# EAGLE design arduinoXbeere (EAGLE 4.16)
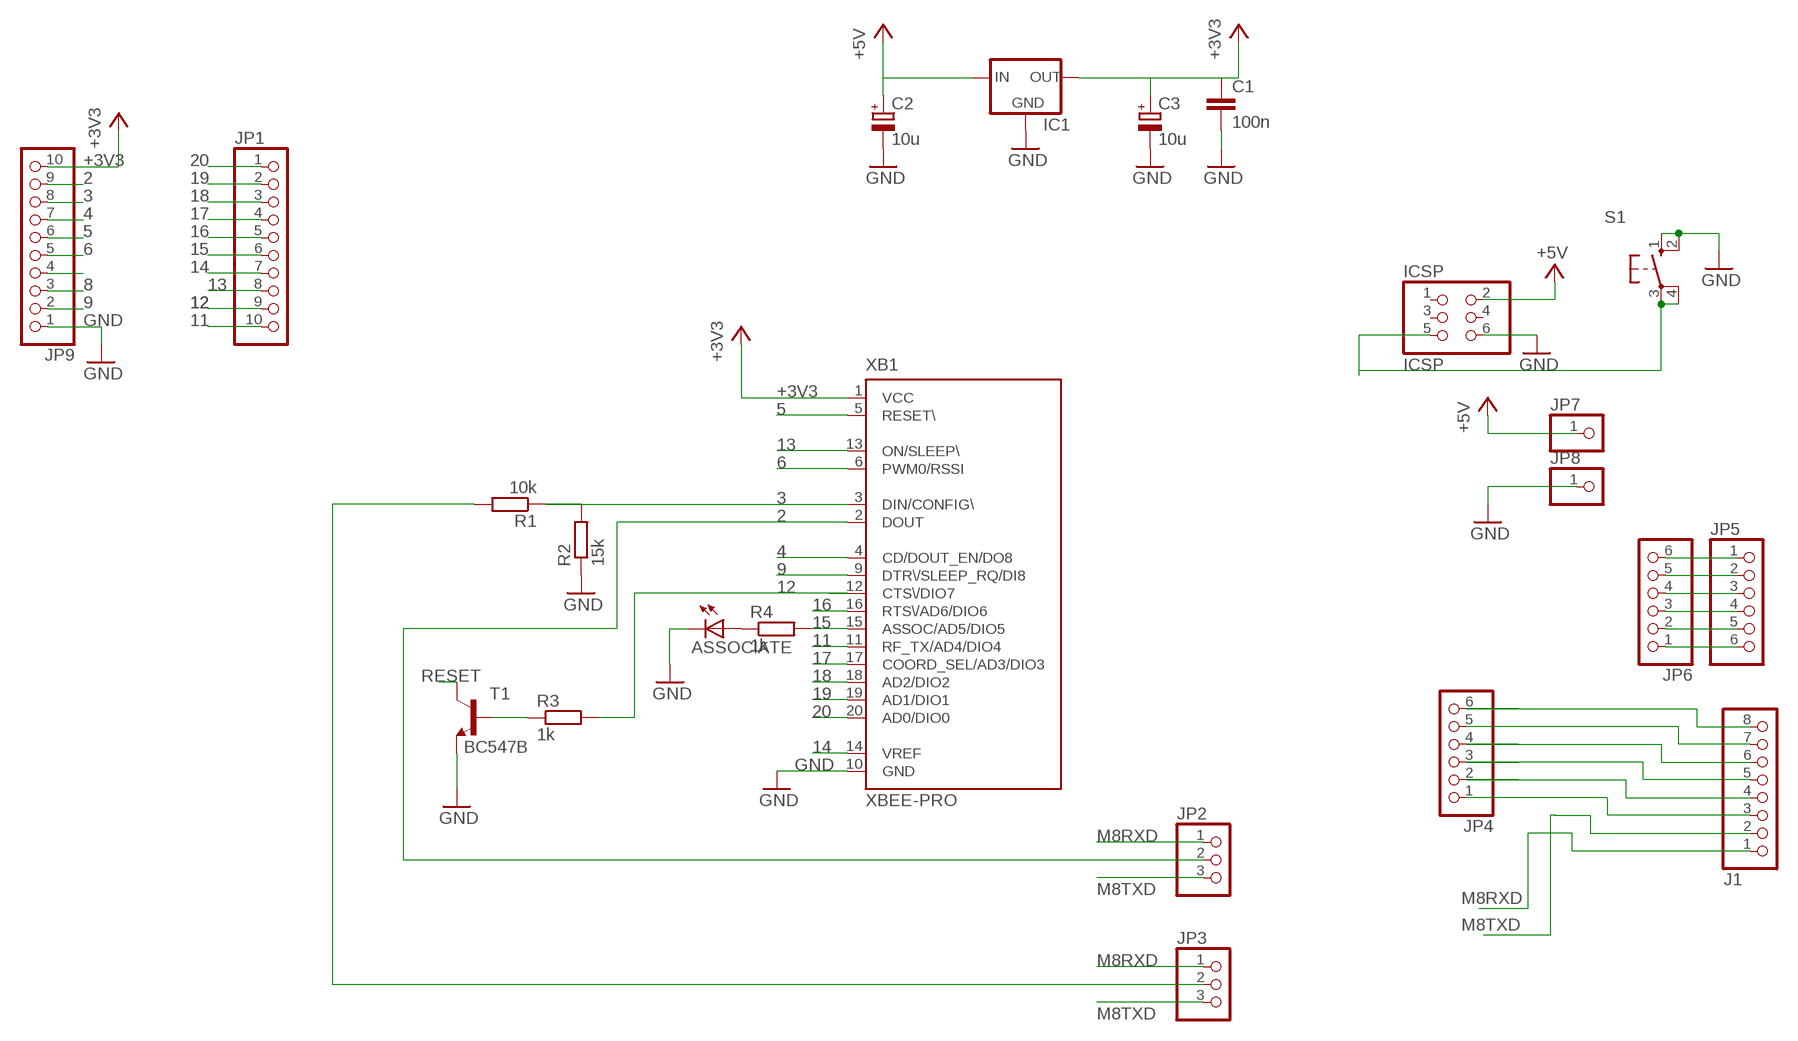
[diagram p0: schematic, sheet 1]

## Parts
ASSOCIATE  LED3MM  [LED3MM]
C1  100n  C-EU025-025X050  [C025-025X050]
C2  10u  CPOL-EUE2.5-7  [E2,5-7]
C3  10u  CPOL-EUE2.5-7  [E2,5-7]
IC1  78XXL  [78XXL]
ICSP  ICSP  PINHD-2X3  [2X03]
J1  PINHD-1X8  [1X08]
JP1  PINHD-1X10  [1X10]
JP2  PINHD-1X3  [1X03]
JP3  PINHD-1X3  [1X03]
JP4  PINHD-1X6  [1X06]
JP5  PINHD-1X6  [1X06]
JP6  PINHD-1X6  [1X06]
JP7  PINHD-1X1  [1X01]
JP8  PINHD-1X1  [1X01]
JP9  PINHD-1X10  [1X10]
R1  10k  R-EU_0207/10  [0207/10]
R2  15k  R-EU_0207/10  [0207/10]
R3  1k  R-EU_0207/10  [0207/10]
R4  1k  R-EU_0207/10  [0207/10]
S1  10-XX  [B3F-10XX]
T1  BC547B  [TO92]
XB1  XBEE-PRO  [XBEE-PRO]

## Nets
2: JP2.2 JP9.9 XB1.2(DOUT)
3: JP9.8 R1.1 R2.2 XB1.3(DIN/CONFIG\)
4: JP9.7 XB1.4(CD/DOUT_EN/DO8)
5: JP9.6 XB1.5(RESET\)
6: JP9.5 XB1.6(PWM0/RSSI)
8: JP9.3
9: JP9.2 XB1.9(DTR\/SLEEP_RQ/DI8)
11: JP1.10 XB1.11(RF_TX/AD4/DIO4)
12: JP1.9 R3.2 XB1.12(CTS\/DIO7)
13: JP1.8 XB1.13(ON/SLEEP\)
14: JP1.7 XB1.14(VREF)
15: JP1.6 R4.2 XB1.15(ASSOC/AD5/DIO5)
16: JP1.5 XB1.16(RTS\/AD6/DIO6)
17: JP1.4 XB1.17(COORD_SEL/AD3/DIO3)
18: JP1.3 XB1.18(AD2/DIO2)
19: JP1.2 XB1.19(AD1/DIO1)
20: JP1.1 XB1.20(AD0/DIO0)
+3V3: C1.1 C3.+ IC1.OUT JP9.10 XB1.1(VCC)
+5V [power]: C2.+ IC1.IN ICSP.2 JP7.1
GND [power]: ASSOCIATE.K(C) C1.2 C2.- C3.- IC1.GND ICSP.6 JP8.1 JP9.1 R2.1 S1.1(S) S1.2(S1) T1.1(E) XB1.10(GND)
M8RXD: J1.1 JP2.1 JP3.1
M8TXD: J1.2 JP2.3 JP3.3
N$1: ASSOCIATE.A R4.1
N$2: JP5.6 JP6.1
N$3: JP5.5 JP6.2
N$4: JP5.4 JP6.3
N$5: JP3.2 R1.2
N$6: R3.1 T1.2(B)
N$8: JP5.3 JP6.4
N$9: JP5.2 JP6.5
N$10: J1.3 JP4.1
N$11: J1.4 JP4.2
N$12: J1.5 JP4.3
N$13: J1.6 JP4.4
N$14: J1.7 JP4.5
N$15: J1.8 JP4.6
N$16: JP5.1 JP6.6
N$19: JP9.4
RESET: ICSP.5 S1.3(P) S1.4(P1) T1.3(C)
Unconnected: ICSP.1 ICSP.3 ICSP.4

## Library data of the parts
ASSOCIATE = led:LED: LED OSRAM: - CHIPLED LG R971, LG N971, LY N971, LG Q971, LY Q971, LO R971, LY R971 LH N974, LH R974 LS Q976, LO Q976, LY Q976 LO Q996 - Hyper CHIPLED LW Q18S LB Q993, LB Q99A, LB R99A - SideLED LS A670, LO A670, LY A670, LG A670, LP A670 LB A673, LV A673, LT A673, LW A673 LH A674 LY A675 LS A676, LA A676, LO A676, LY A676, LW A676 LS A679, LY A679, LG A679 - Hyper Micro SIDELED® LS Y876, LA Y876, LO Y876, LY Y876 LT Y87S - SmartLED LW L88C, LW L88S LB L89C, LB L89S, LG L890 LS L89K, LO L89K, LY L89K LS L896, LA L896, LO L896, LY L896 - TOPLED LS T670, LO T670, LY T670, LG T670, LP T670 LSG T670, LSP T670, LSY T670, LOP T670, LYG T670 LG T671, LOG T671, LSG T671 LB T673, LV T673, LT T673, LW T673 LH T674 LS T676, LA T676, LO T676, LY T676, LB T676, LH T676, LSB T676, LW T676 LB T67C, LV T67C, LT T67C, LS T67K, LO T67K, LY T67K, LW E67C LS E67B, LA E67B, LO E67B, LY E67B, LB E67C, LV E67C, LT E67C LW T67C LS T679, LY T679, LG T679 LS T770, LO T770, LY T770, LG T770, LP T770 LB T773, LV T773, LT T773, LW T773 LH T774 LS E675, LA E675, LY E675, LS T675 LS T776, LA T776, LO T776, LY T776, LB T776 LHGB T686 LT T68C, LB T68C - Hyper Mini TOPLED® LB M676 - Mini TOPLED Santana® LG M470 LS M47K, LO M47K, LY M47K Source: http://www.osram.convergy.de/
C1 = rcl:C-EU: CAPACITOR, European symbol
C2 C3 = rcl:CPOL-EU: POLARIZED CAPACITOR, European symbol
IC1 = v-reg:78XXL: VOLTAGE REGULATOR
ICSP = pinhead:PINHD-2X3: PIN HEADER
J1 = pinhead:PINHD-1X8: PIN HEADER
JP1 JP9 = pinhead:PINHD-1X10: PIN HEADER
JP2 JP3 = pinhead:PINHD-1X3: PIN HEADER
JP4-JP6 = pinhead:PINHD-1X6: PIN HEADER
JP7 JP8 = pinhead:PINHD-1X1: PIN HEADER
R1-R4 = rcl:R-EU_: RESISTOR, European symbol
S1 = switch-omron:10-XX: OMRON SWITCH
T1 = transistor-npn:BC547*: NPN Transistor
XB1 = maxstream:XBEE: XBee (TM) /XBee-PRO(TM) OEM RF Modules Source: MaxStream, Inc. xbee_productmanual.pdf

## Net classes
1 power: width 0.61 mm

## Board
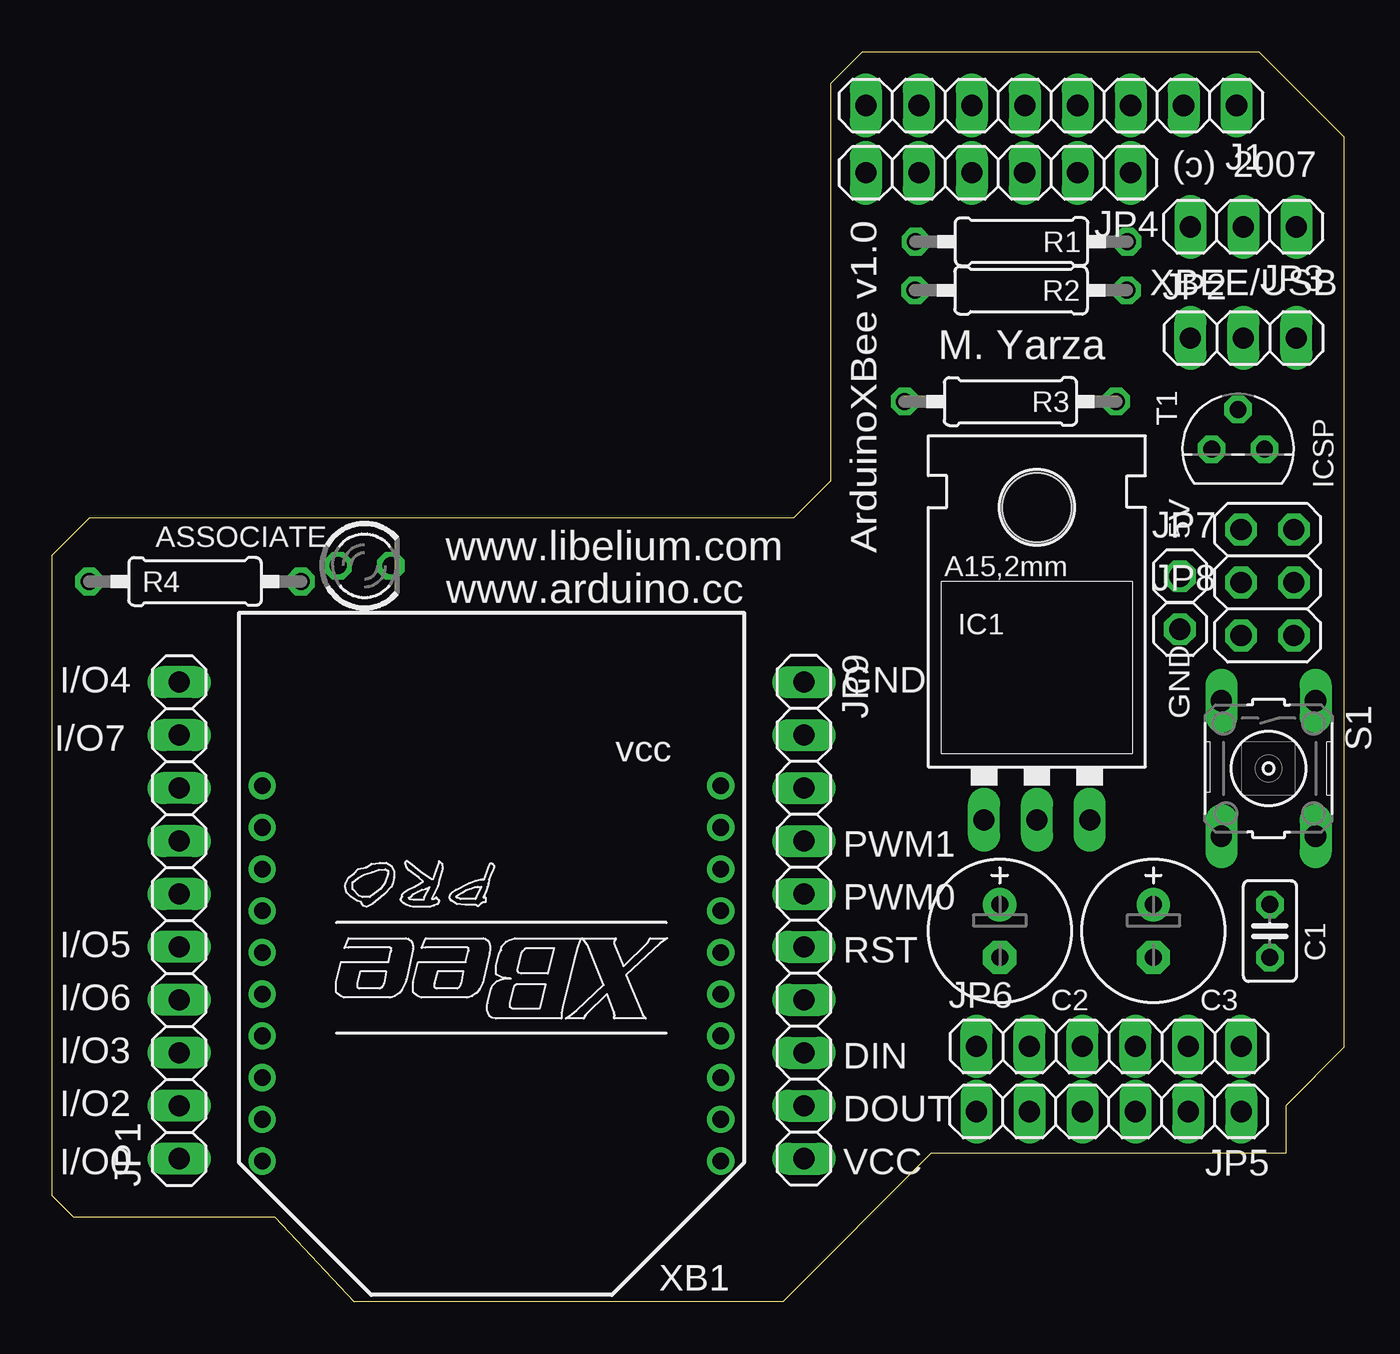
[diagram p1: board, top side]
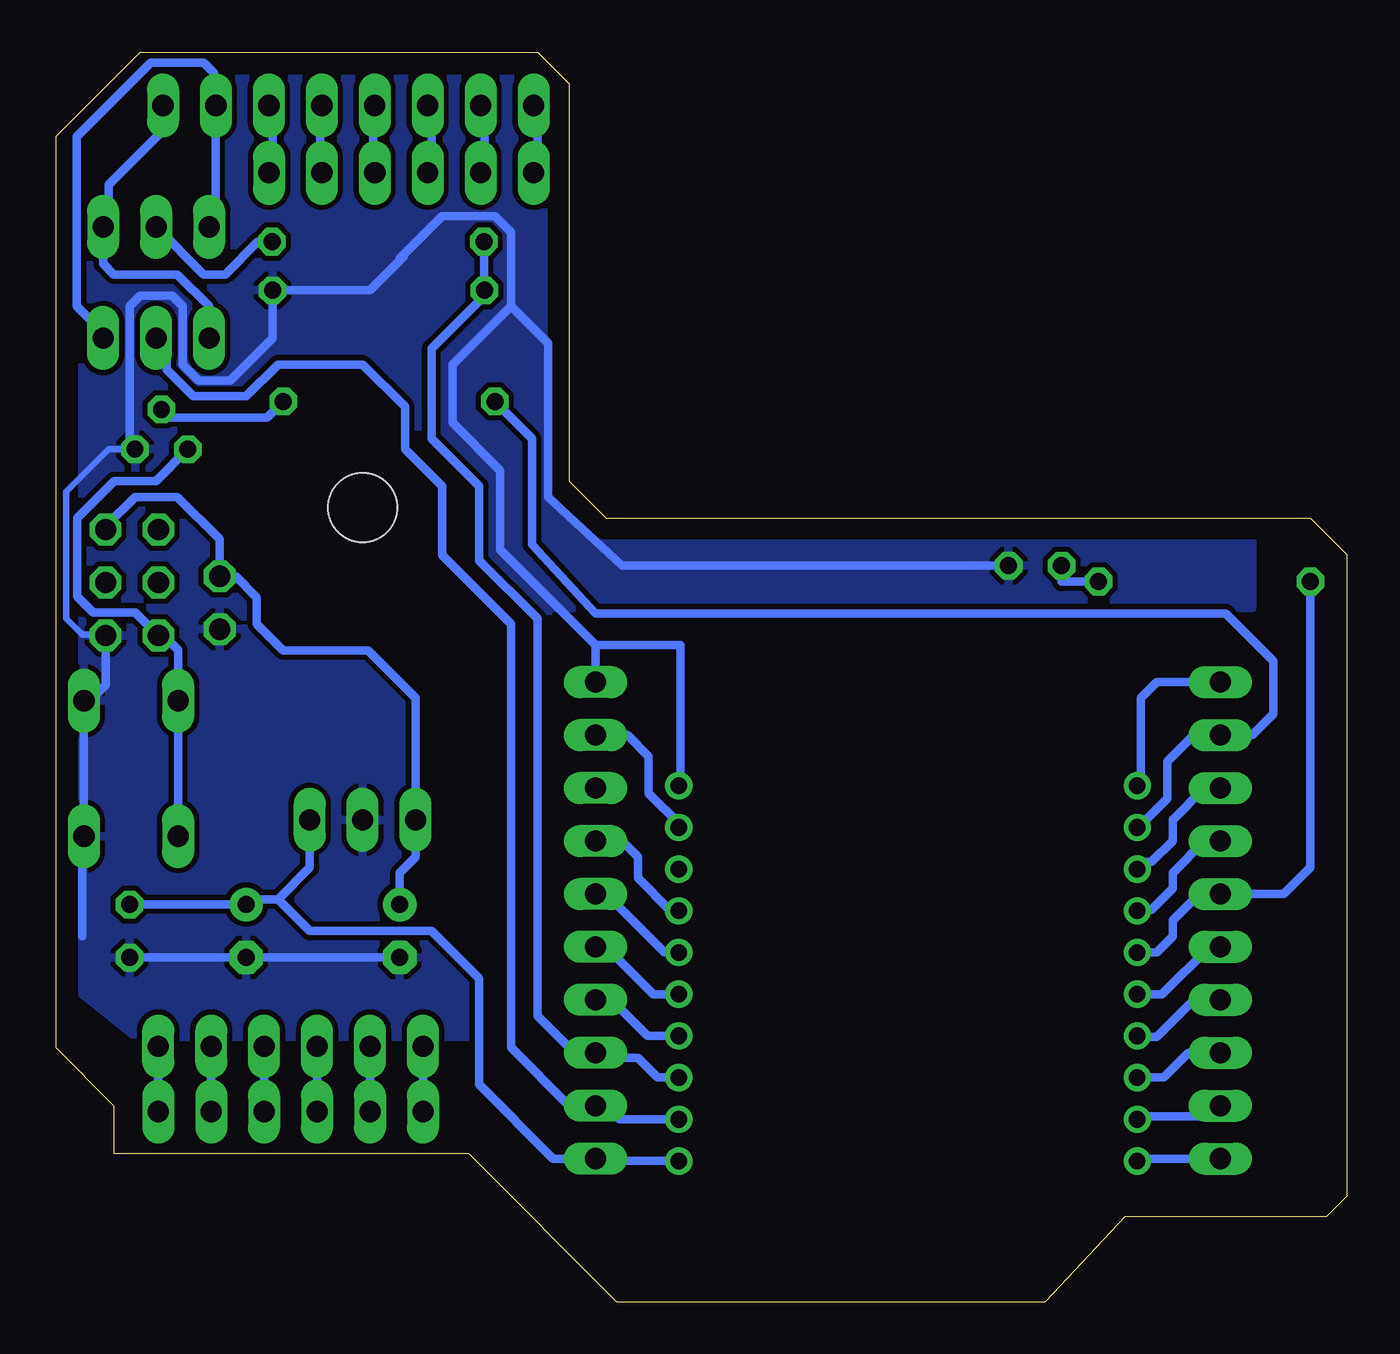
[diagram p2: board, bottom side, seen from below]

Size 61.98 x 59.94 mm. Coordinates in mm from the lower left corner, seen from the top.
Outline: 61.98,44.7 61.98,44.45
Outline: 61.98,44.45 61.98,55.88 57.91,59.94 38.86,59.94 37.34,58.42 37.34,39.37
Outline: 61.98,44.45 61.98,12.19 59.18,9.4 59.18,7.11 42.16,7.11 35.05,0 14.48,0 10.67,4.06 1.02,4.06 0,5.08 0,35.81 1.78,37.59 35.56,37.59 37.34,39.37
Outline: 37.34,39.37 37.34,39.34
Copper layers (1*16): Top 0.035mm / dielectric 1.5mm / Bottom 0.035mm
Design rules "default": minimum track width 10mil, minimum drill 24mil, track to track 8mil, track to pad 8mil, pad to pad 8mil, via to via 8mil, smd to smd 8mil, copper to edge 40mil, drill to drill 8mil, minimum pad ring 10mil, minimum via ring 8mil, stop-mask expansion 4mil, vias tented up to drill 0mil, thermal gap 10mil

### Footprints (pad centres in the part's own frame; a part is rotated, then mirrored left to right if it is on the bottom)
LED3MM = drill 0.813 octagon: A -1.27,0; K 1.27,0
C025-025X050 = drill 0.813 octagon: 1 -1.27,0; 2 1.27,0
E2,5-7 = drill 0.813 pad 1.6 round: + -1.27,0 | drill 0.813 pad 1.6 octagon: - 1.27,0
78XXL = drill 1.016 long: GND 0,-3.81; IN -2.54,-3.81; OUT 2.54,-3.81 | hole 3.302: 0,11.176
2X03 = drill 1.016 octagon: 1 -2.54,-1.27; 2 -2.54,1.27; 3 0,-1.27; 4 0,1.27; 5 2.54,-1.27; 6 2.54,1.27
1X08 = drill 1.016 long: 1 -8.89,0; 2 -6.35,0; 3 -3.81,0; 4 -1.27,0; 5 1.27,0; 6 3.81,0; 7 6.35,0; 8 8.89,0
1X10 = drill 1.016 long: 1 -11.43,0; 2 -8.89,0; 3 -6.35,0; 4 -3.81,0; 5 -1.27,0; 6 1.27,0; 7 3.81,0; 8 6.35,0; 9 8.89,0; 10 11.43,0
1X03 = drill 1.016 long: 1 -2.54,0; 2 0,0; 3 2.54,0
1X06 = drill 1.016 long: 1 -6.35,0; 2 -3.81,0; 3 -1.27,0; 4 1.27,0; 5 3.81,0; 6 6.35,0
1X01 = drill 1.016 octagon: 1 0,0
0207/10 = drill 0.813 octagon: 1 -5.08,0; 2 5.08,0
B3F-10XX = drill 1.016 long: 1 -3.251,2.261; 2 3.251,2.261; 3 -3.251,-2.261; 4 3.251,-2.261
TO92 = drill 0.813 octagon: 1 1.27,0; 2 0,1.905; 3 -1.27,0
XBEE-PRO = drill 0.8 pad 1.27 round: 1 -11,9; 2 -11,7; 3 -11,5; 4 -11,3; 5 -11,1; 6 -11,-1; 7 -11,-3; 8 -11,-5; 9 -11,-7; 10 -11,-9; 11 11,-9; 12 11,-7; 13 11,-5; 14 11,-3; 15 11,-1; 16 11,1; 17 11,3; 18 11,5; 19 11,7; 20 11,9

### Placement (x,y rotation side)
ASSOCIATE  14.99,35.31 0 top
C1  58.42,17.78 270 top
C2  45.47,17.78 270 top
C3  52.83,17.78 270 top
IC1  47.24,26.92 0 top
ICSP  58.31,34.49 270 top
J1  47.93,57.38 180 top
JP1  6.1,18.29 90 top
JP2  57.15,46.23 0 top
JP3  57.15,51.56 180 top
JP4  45.39,54.15 180 top
JP5  50.7,9.12 180 top
JP6  50.7,12.24 0 top
JP7  54.1,34.8 0 top
JP8  54.1,32.26 0 top
JP9  36.07,18.29 270 top
R1  46.51,50.85 0 top
R2  46.48,48.51 180 top
R3  45.97,43.18 180 top
R4  6.86,34.54 180 top
S1  58.36,25.58 270 top
T1  56.9,40.89 0 top
XB1  21.08,15.75 180 top

### Tracks (layer width: path | path; a pad name or v marks a point on that pad's centre or on a via)
2
  Bottom 0.406: 57.15,46.48 JP2.2 56.64,45.72 56.64,44.7 55.37,43.43 52.83,43.43 51.31,44.96 47.24,44.96 45.21,42.93 45.21,40.89 43.43,39.12 43.43,35.81 40.13,32.51 40.13,12.19 37.34,9.4 JP9.9 35.56,9.4 34.91,8.75 XB1.2
3
  Bottom 0.406: R1.1 41.43,48.54 R2.2 41.4,48.26 43.94,45.72 43.94,41.4 41.66,39.12 41.66,35.56 38.86,32.77 38.86,13.72 37.08,11.94 JP9.8 | XB1.3 33.1,10.75 34.04,11.68 35.81,11.68 JP9.8 | JP9.8 35.81,11.94
4
  Bottom 0.406: XB1.4 33.58,12.75 35.05,14.22 36.07,14.22 36.32,14.48 JP9.7
5
  Bottom 0.406: XB1.5 33.29,14.75 35.56,17.02 JP9.6
6
  Bottom 0.406: XB1.6 32.75,16.75 35.56,19.56 JP9.5
9
  Bottom 0.406: JP9.2 34.54,27.18 33.53,26.16 33.53,24.38 32,22.86 32.08,22.78 XB1.9
11
  Bottom 0.406: JP1.10 9.14,29.72 9.91,28.96 9.91,24.89 10.08,24.72 | 10.08,24.72 10.16,24.64 | XB1.11 10.08,24.72
12
  Bottom 0.406: XB1.12 10.02,22.75 8.64,24.13 8.64,25.91 7.37,27.18 JP1.9 4.57,27.18 3.56,28.19 3.56,30.73 5.84,33.02 36.07,33.02 39.12,36.32 39.12,41.4 R3.2
13
  Bottom 0.406: JP1.8 6.86,24.64 8.38,23.11 8.38,22.1 9.4,21.08 9.65,21.08 10.08,20.65 | 10.08,20.65 10.16,20.57 | XB1.13 10.08,20.65
14
  Bottom 0.406: JP1.7 6.86,22.1 8.38,20.57 8.38,19.81 9.4,18.8 10.16,18.8 10.11,18.75 XB1.14
15
  Bottom 0.406: XB1.15 9.92,16.75 9.91,16.76 9.14,16.76 8.38,17.53 8.38,18.29 7.11,19.56 JP1.6 3.05,19.56 1.78,20.83 R4.2
16
  Bottom 0.406: JP1.5 6.6,17.02 8.89,14.73 9.91,14.73 9.92,14.75 XB1.16
17
  Bottom 0.406: JP1.4 7.37,14.48 9.14,12.7 9.91,12.7 9.95,12.75 XB1.17
18
  Bottom 0.406: XB1.18 8.81,10.75 7.62,11.94 JP1.3
19
  Bottom 0.406: JP1.2 6.6,8.89 10.16,8.89 10.08,8.81 XB1.19
20
  Bottom 0.406: XB1.20 10.02,6.75 9.91,6.86 JP1.1
+3V3
  Bottom 0.406: IC1.OUT 49.78,20.83 51.31,19.3 | 53.09,19.05 C3.+ | 51.31,19.3 52.83,19.3 53.09,19.05 | 36.32,6.86 JP9.10 | XB1.1 36.21,6.75 36.32,6.86 | 58.17,19.05 C1.1 | 53.09,19.05 58.17,19.05 | 58.17,19.05 58.17,19.3 | 36.32,6.86 38.1,6.86 41.66,10.41 41.66,15.49 43.94,17.78 49.78,17.78 51.31,19.3
+5V
  Bottom 0.406: ICSP.2 59.58,37.2 58.17,38.61 56.13,38.61 54.1,36.58 JP7.1 53.34,34.8 52.32,33.78 52.32,32.51 51.05,31.24 46.99,31.24 44.7,28.96 IC1.IN 44.7,21.34 45.47,20.57 C2.+
GND
  Bottom 0.305: R2.1 49.53,48.51 | 58.42,40.89 59.44,40.89 61.47,38.86 61.47,32.77 60.71,32 59.69,32 59.64,31.95
  Bottom 0.406: 60.71,22.35 60.62,22.44 S1.1 60.58,28.83 60.45,28.7 59.58,29.58 59.58,31.89 59.64,31.95 ICSP.6 | 60.71,22.35 60.68,22.33 S1.2 60.62,22.19 60.71,22.1 | 60.71,22.1 60.71,21.59 | 60.71,22.35 60.71,22.1 | 60.71,22.1 60.71,17.53 | T1.1 58.42,40.89 58.42,47.75 57.91,48.26 56.39,48.26 55.88,47.75 55.88,44.96 55.12,44.2 53.59,44.2 51.56,46.23 R2.1 46.89,48.51 45.41,49.99 | 45.41,49.99 45.29,50.11 | 40.13,47.75 42.93,44.96 42.93,42.16 40.64,39.88 40.64,36.07 36.07,31.5 | 40.13,47.75 40.13,51.31 40.89,52.07 43.43,52.07 45.47,50.04 45.41,49.99 | 36.07,31.5 32,31.5 32,24.67 | 32,24.67 32,24.64 | 32,24.67 XB1.10 | 36.07,31.5 JP9.1 | C2.- C3.- 58.17,16.51 58.42,16.76 C1.2 | ASSOCIATE.K 34.8,35.31 38.35,38.61 38.35,45.97 40.13,47.75
  pour Bottom (isolate 0.254): 4.57,33.27 4.57,36.83 35.81,36.83 38.1,39.12 38.1,58.67 58.67,58.67 60.71,56.39 60.71,14.73 58.17,12.7 38.1,12.7 38.35,13.72 38.35,33.27
M8RXD
  Bottom 0.406: J1.1 56.82,56.21 59.44,53.59 59.44,52.07 59.69,51.82 JP3.1 59.69,49.78 59.18,49.28 56.13,49.28 54.61,47.75 JP2.1
M8TXD
  Bottom 0.406: JP3.3 54.36,51.56 54.28,51.64 J1.2 54.28,58.6 54.36,58.67 54.36,58.93 54.86,59.44 57.4,59.44 60.96,55.88 60.96,47.75 59.69,46.48 JP2.3
N$1
  Bottom 0.406: R4.1 13.72,34.54 ASSOCIATE.A
N$2
  Bottom 0.406: JP6.1 44.35,12.22 44.4,12.17 44.35,12.12 JP5.6
N$3
  Bottom 0.406: JP6.2 46.91,12.24 46.89,12.22 JP5.5
N$4
  Bottom 0.406: 49.43,12.32 JP6.3 | JP5.4 49.43,12.32 | 49.43,12.32 49.45,12.34
N$5
  Bottom 0.406: JP3.2 54.86,49.28 53.85,49.28 52.27,50.85 R1.2
N$6
  Bottom 0.406: R3.1 51.82,42.42 56.64,42.42 56.64,42.55 T1.2
N$8
  Bottom 0.406: 51.89,12.24 51.87,12.27 | 51.89,12.24 JP6.4 | JP5.3 51.97,12.17 51.89,12.24
N$9
  Bottom 0.406: 54.51,12.37 JP6.5 JP5.2
N$10
  Bottom 0.406: JP4.1 51.56,54.33 51.56,57.2 J1.3
N$11
  Bottom 0.406: JP4.2 49.25,54.1 49.28,54.1 49.28,57.31 J1.4
N$12
  Bottom 0.406: JP4.3 46.74,54.23 46.74,57.31 J1.5
N$13
  Bottom 0.406: JP4.4 44.07,54.1 43.94,54.1 43.94,57.2 J1.6
N$14
  Bottom 0.406: JP4.5 41.4,54.33 41.4,57.2 J1.7
N$15
  Bottom 0.406: JP4.6 38.86,54.33 38.86,57.2 J1.8
N$16
  Bottom 0.406: JP5.1 JP6.6 56.9,12.39
N$19
  Bottom 0.406: 32.26,18.8 32.51,18.8 34.04,20.32 34.04,21.34 34.8,22.1 JP9.4
RESET
  Bottom 0.406: S1.4 56.09,28.73 56.14,28.78 S1.3 56.09,31.25 56.9,32.06 57,31.95 ICSP.5 57.05,31.95 58.16,33.06 60.18,33.06 60.93,33.82 60.93,37.6 59.17,39.36 57.15,39.36 T1.3

### Text on the board
tNames: (c) | 2007 | ArduinoXBee v1.0 | XBEE/USB | M. Yarza | 5V | www.libelium.com | www.arduino.cc | I/O4 | GND | GND | I/O7 | vcc | PWM1 | PWM0 | I/O5 | RST | I/O6 | I/O3 | DIN | I/O2 | DOUT | I/O0 | VCC